# EasyEDA schematic 1-Schematic_ACS2STM-alt-DB19.json
TITLE: ACSI2STM Modified; REV: 3; Date: 2023-06-16; Sheet: 1/1; Drawn By: jfcretro
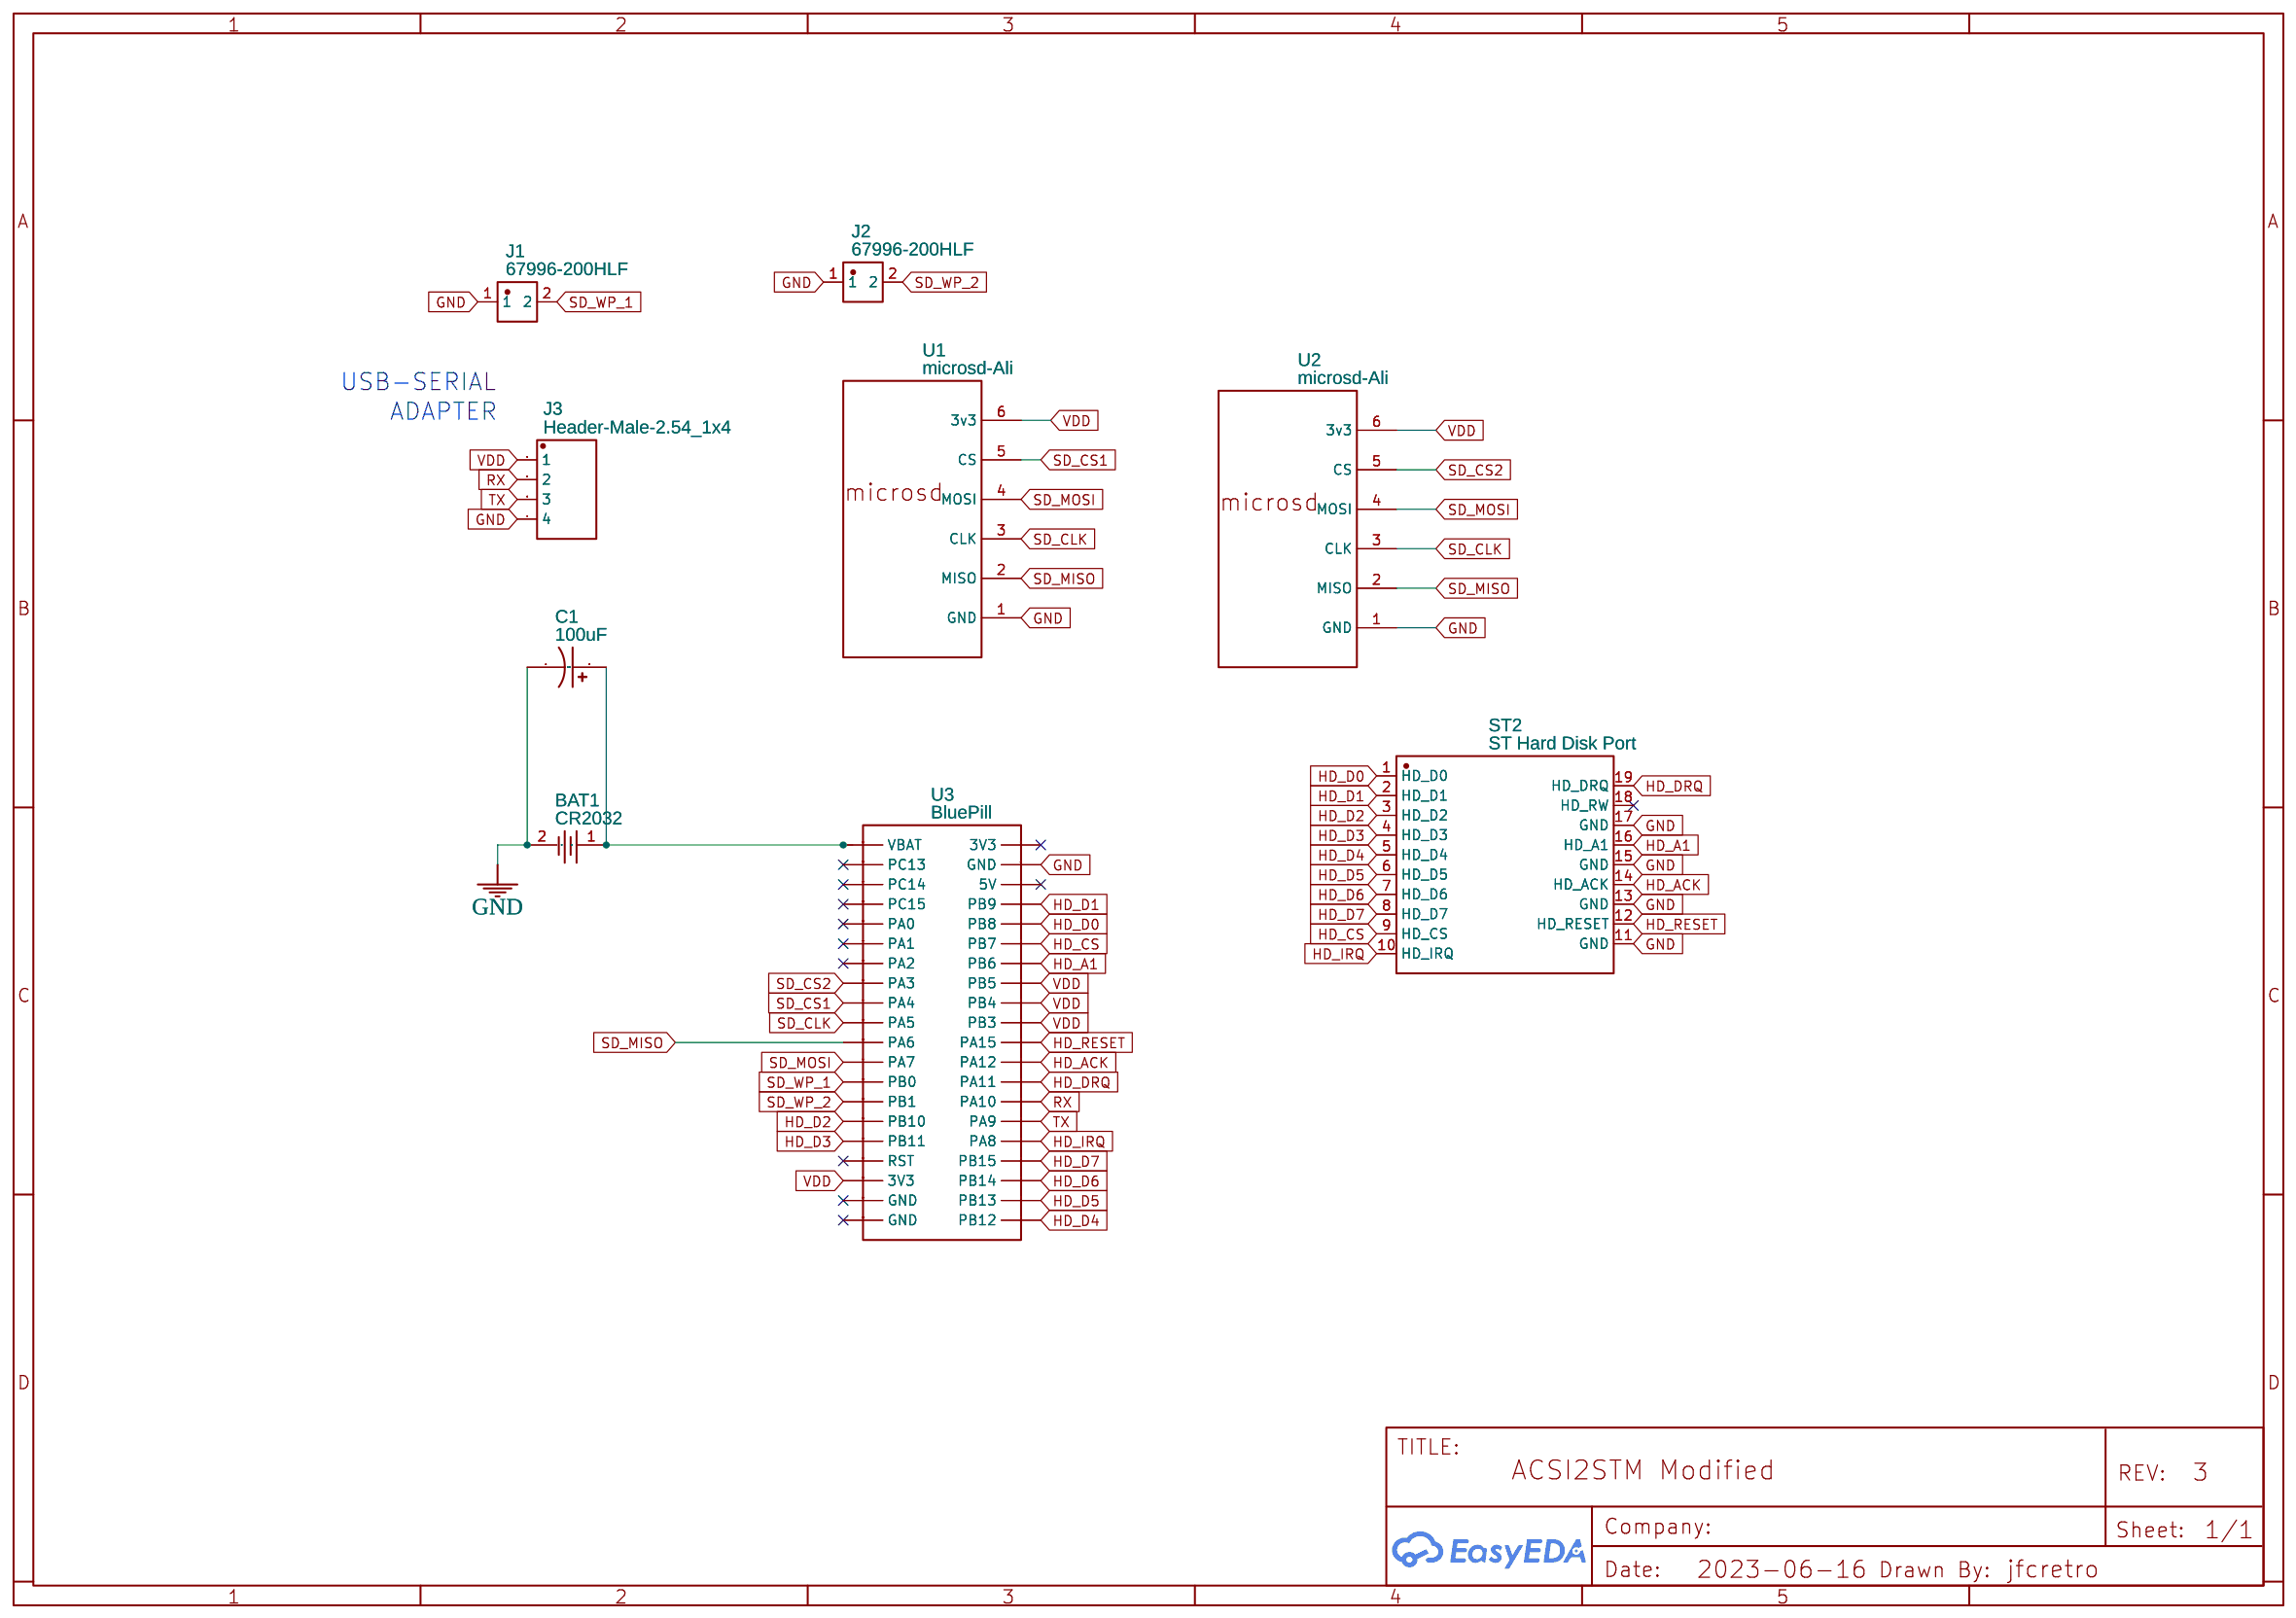
[diagram p0: schematic sheet]

## Parts
BAT1  CR2032  [BAT-TH_CR2032-1]
C1  100uF  [CAP-D6.3×F2.5]
J1  67996-200HLF  [HDR-TH_2P-P2.54-V-M-R2-C1-S2.54]
J2  67996-200HLF  [HDR-TH_2P-P2.54-V-M-R2-C1-S2.54]
J3  Header-Male-2.54_1x4  [HDR-TH_4P-P2.54-V-M]
ST2  ST Hard Disk Port  [ST_DISK]
U1  microsd-Ali  [MICROSDADAPTER]
U2  microsd-Ali  [MICROSDADAPTER]
U3  BluePill  [BLUEPILL]

## Library data of the parts
BAT1 = CR2032_C9900007674: Supplier: LCSC; Supplier Part: C9900007674; Manufacturer: null; link: https://atta.szlcsc.comnull; JLCPCB Part Class: Extended Part; Contributor: lcsc
C1 = CE_TH_D6.3×F2.5_US: Contributor: LCEDA_Lib
J1 J2 = 67996-200HLF: Supplier: LCSC; Supplier Part: C236045; Manufacturer: Amphenol; Contributor: LCSC
J3 = Header-Male-2.54_1x4: Supplier: LCSC; Manufacturer: Ckmtw(灿科盟); Manufacturer Part: B-2100S04P-A110; Contributor: LCSC; Supplier Part: C124378; JLCPCB Part Class: Extended Part
ST2 = ST Hard Disk Port: Contributor: jfceklosky
U1 = microsd-Ali: Contributor: jfceklosky
U2 = microsd-Ali: Contributor: jfceklosky; Package Display: No
U3 = BluePill: Contributor: alexander.gavrilenko

## Nets
GND: BAT1.2 C1.2 J1.1 J2.1 J3.4 ST2.11(GND) ST2.13(GND) ST2.15(GND) ST2.17(GND) U1.1(GND) U2.1(GND) U3.GND_3(GND)
VDD: J3.1 U1.6(3v3) U2.6(3v3) U3.3V3_1(3V3) U3.PB3 U3.PB4 U3.PB5
HD_A1: ST2.16(HD_A1) U3.PB6
HD_ACK: ST2.14(HD_ACK) U3.PA12
HD_CS: ST2.9(HD_CS) U3.PB7
HD_D0: ST2.1(HD_D0) U3.PB8
HD_D1: ST2.2(HD_D1) U3.PB9
HD_D2: ST2.3(HD_D2) U3.PB10
HD_D3: ST2.4(HD_D3) U3.PB11
HD_D4: ST2.5(HD_D4) U3.PB12
HD_D5: ST2.6(HD_D5) U3.PB13
HD_D6: ST2.7(HD_D6) U3.PB14
HD_D7: ST2.8(HD_D7) U3.PB15
HD_DRQ: ST2.19(HD_DRQ) U3.PA11
HD_IRQ: ST2.10(HD_IRQ) U3.PA8
HD_RESET: ST2.12(HD_RESET) U3.PA15
RX: J3.2 U3.PA10
SD_CLK: U1.3(CLK) U2.3(CLK) U3.PA5
SD_CS1: U1.5(CS) U3.PA4
SD_CS2: U2.5(CS) U3.PA3
SD_MISO: U1.2(MISO) U2.2(MISO) U3.PA6
SD_MOSI: U1.4(MOSI) U2.4(MOSI) U3.PA7
SD_WP_1: J1.2 U3.PB0
SD_WP_2: J2.2 U3.PB1
TX: J3.3 U3.PA9
Net-(BAT1-1): BAT1.1 C1.1 U3.VBAT

Not connected (* = marked no-connect by the designer): ST2 18(HD_RW)*; U3 3V3_2(3V3)* 5V* GND_1(GND)* GND_2(GND)* PA0* PA1* PA2* PC13* PC14* PC15* RST*

## Notes on the sheet
- USB-SERIAL
- ADAPTER
